# EAGLE design base-2u-motor-dimmer (EAGLE 6.2)
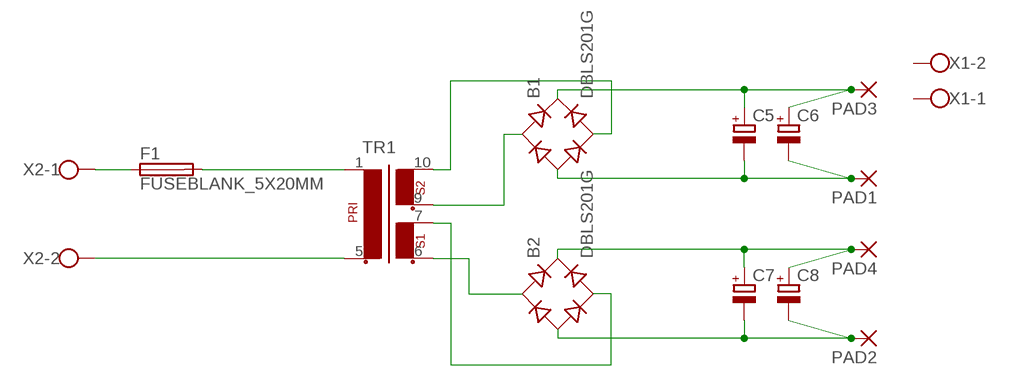
[diagram p0: schematic, sheet 1]

## Parts
B1  DBLS201G  [DBS]
B2  DBLS201G  [DBS]
C5  CPOL-EUTT2D5L  [TT2D5L]
C6  CPOL-EUTT2D5L  [TT2D5L]
C7  CPOL-EUTT2D5L  [TT2D5L]
C8  CPOL-EUTT2D5L  [TT2D5L]
F1  FUSEBLANK_5X20MM  [FUSE_HOLDER_5X20MM]
PAD1  1,6/0,8  [1,6/0,8]
PAD2  1,6/0,8  [1,6/0,8]
PAD3  1,6/0,8  [1,6/0,8]
PAD4  1,6/0,8  [1,6/0,8]
TR1  EI30-2  [EI30-2]
X1  W237-102  [W237-102]
X2  W237-102  [W237-102]

## Nets
N$1: B2.AC2 TR1.7
N$2: B2.AC1 TR1.6
N$3: F1.1 X2.1
N$4: F1.2
N$5: X2.2
N$6: B1.AC1 TR1.9
N$7: B1.AC2 TR1.10
N$9: B1.+ C5.+ C6.+ PAD3.1(P)
N$10: B1.- C5.- C6.- PAD1.1(P)
N$11: B2.- C7.- C8.- PAD2.1(P)
N$13: B2.+ C7.+ C8.+ PAD4.1(P)
Unconnected: TR1.1 TR1.5 X1.1 X1.2

## Library data of the parts
B1 B2 = rectifier:DB?*G: Single Phase 1.0 AMP Glass Passivated Bridge Rectifier Taiwan Semiconductor Co.,Ltd. - TSC Source: http://www.taiwansemi.com/TSCbig5/ezcatfiles/cust/img/img/db101g.pdf http://www.ts.com.tw/db/pictures/modules/PDT/PDT060207001/DBLS201G.pdf
C5-C8 = rcl:CPOL-EU: POLARIZED CAPACITOR, European symbol
F1 = fuse:FUSE: Fuse
PAD1-PAD4 = wirepad:1,6/0,8: THROUGH-HOLE PAD
TR1 = trafo:EI30-2: TRANSFORMER 1 primary winding, 2 secondary windings ERA
X1 X2 = con-wago-500:W237-102: WAGO SCREW CLAMP

## Board
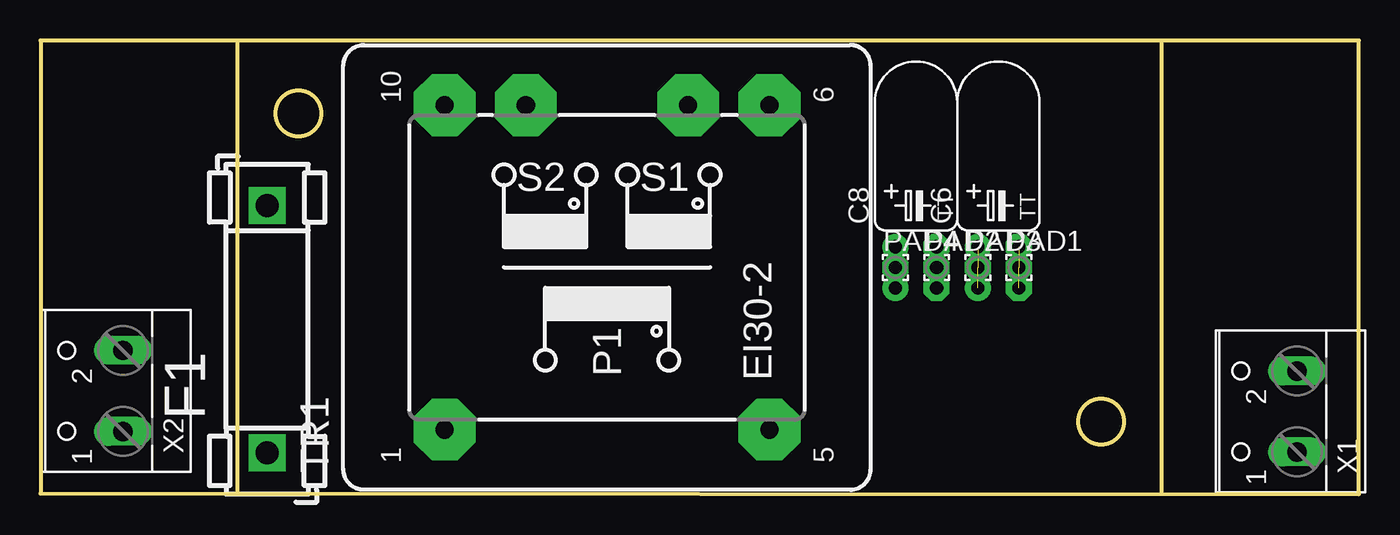
[diagram p1: board, top side]
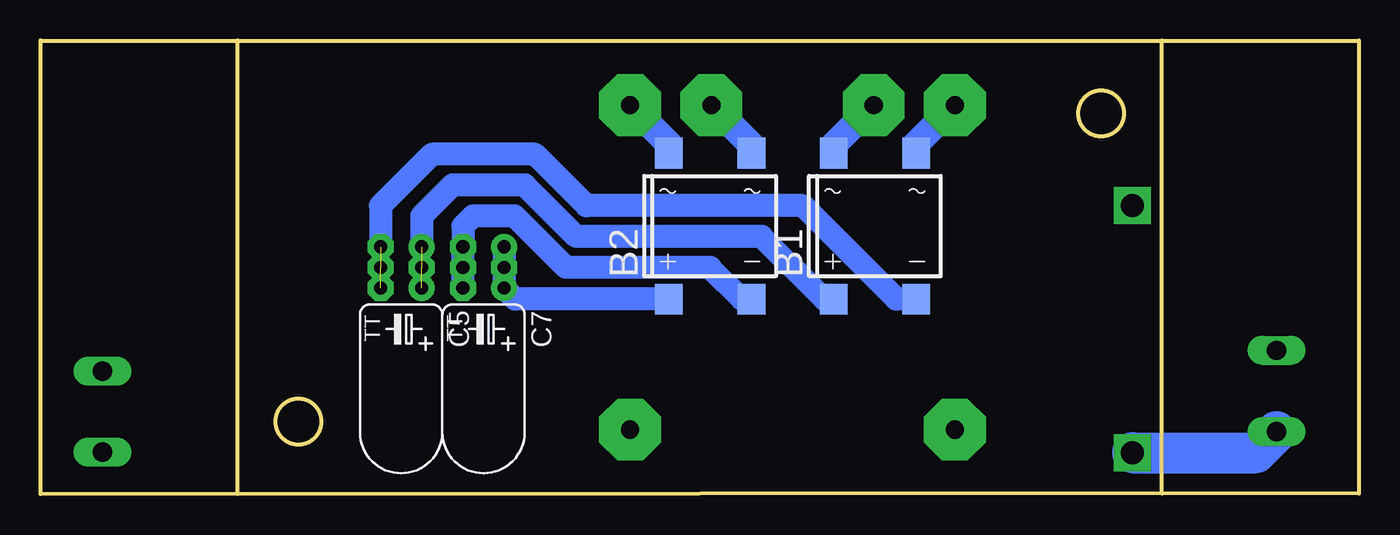
[diagram p2: board, bottom side, seen from below]

Size 81.28 x 27.98 mm. Coordinates in mm from the lower left corner, seen from the top.
Outline: 12.14,27.98 81.28,27.98 81.28,0 0,0.04 0,27.98 12.14,27.98
Outline: 12.14,0.03 12.14,27.98
Outline: 69.14,0.01 69.14,27.98
Outline: circle at 15.89,23.49 radius 1.4
Outline: circle at 65.39,4.49 radius 1.4
Copper layers (1*16): Top 0.035mm / dielectric 1.5mm / Bottom 0.035mm
Design rules: minimum track width 10mil, minimum drill 24mil, track to track 8mil, track to pad 8mil, pad to pad 8mil, via to via 8mil, smd to smd 8mil, copper to edge 40mil, drill to drill 8mil, minimum pad ring 10mil, minimum via ring 8mil, stop-mask expansion 4mil, vias tented up to drill 0mil, thermal gap 10mil

### Footprints (pad centres in the part's own frame; a part is rotated, then mirrored left to right if it is on the bottom)
DBS = smd 1.7 x 1.9: + -2.55,-4.5; - 2.55,-4.5; AC1 -2.55,4.5; AC2 2.55,4.5
TT2D5L = drill 0.813 pad 1.6: + -1.27,0 | drill 0.813 pad 1.6 octagon: - 1.27,0
FUSE_HOLDER_5X20MM = drill 1.422 pad 2.286 square: 1 0,0; 2 15.24,0
1,6/0,8 = drill 0.813 pad 1.6 octagon: 1 0,0
EI30-2 = drill 1.118 pad 3.81 octagon: 1 -10.008,10.008; 5 -10.008,-10.008; 6 10.008,-10.008; 7 10.008,-5.004; 9 10.008,5.004; 10 10.008,10.008
W237-102 = drill 1.194 long: 1 -2.5,-1.27; 2 2.5,-1.27

### Placement (x,y rotation side)
B1  29.84,16.53 0 bottom
B2  40.01,16.53 0 bottom
C5  59.05,12.72 180 bottom
C6  59.05,15.26 0 top
C7  53.98,12.72 180 bottom
C8  53.98,15.26 0 top
F1  13.97,2.56 90 top
PAD1  60.33,13.99 0 top
PAD2  55.24,13.99 0 top
PAD3  57.78,13.99 0 top
PAD4  52.7,13.99 0 top
TR1  34.92,13.99 90 top
X1  76.2,5.1 90 top
X2  3.81,6.37 90 top

### Tracks (layer width: path | path; a pad name or v marks a point on that pad's centre or on a via)
N$1
  Bottom 1.676: B2.AC2 37.45,21.52 TR1.7
N$2
  Bottom 1.676: B2.AC1 42.55,21.62 TR1.6
N$3
  Bottom 2.54: X2.1 5.08,3.83 6.35,2.56 F1.1
N$6
  Bottom 1.676: B1.AC1 32.4,21.52 TR1.9
N$7
  Bottom 1.676: B1.AC2 27.3,21.62 TR1.10
N$9  (2 unrouted)
  Bottom 1.422: B1.+ 32.97,12.03 36.83,15.89 48.26,15.89 51.44,19.07 55.88,19.07 57.78,17.16 C6.+
N$10  (2 unrouted)
  Bottom 1.422: B1.- 28.52,12.03 34.29,17.8 47.62,17.8 50.8,20.98 57.15,20.98 60.33,17.8 C6.-
N$11
  Bottom 1.422: B2.- 38.05,12.03 40.01,13.99 48.9,13.99 52.07,17.16 54.61,17.16 55.24,16.53 C8.- PAD2.1 C7.-
N$13
  Bottom 1.422: B2.+ 52.02,12.03 C7.+ PAD4.1 C8.+

### Text on the board
Measures: 24.74 | 15.24 | 5.74 | 15.89 | 40.64 | 65.39